# Altium schematic sheet Full Design.SchDoc
size A2; SheetNumber: 1; SheetTotal: 1
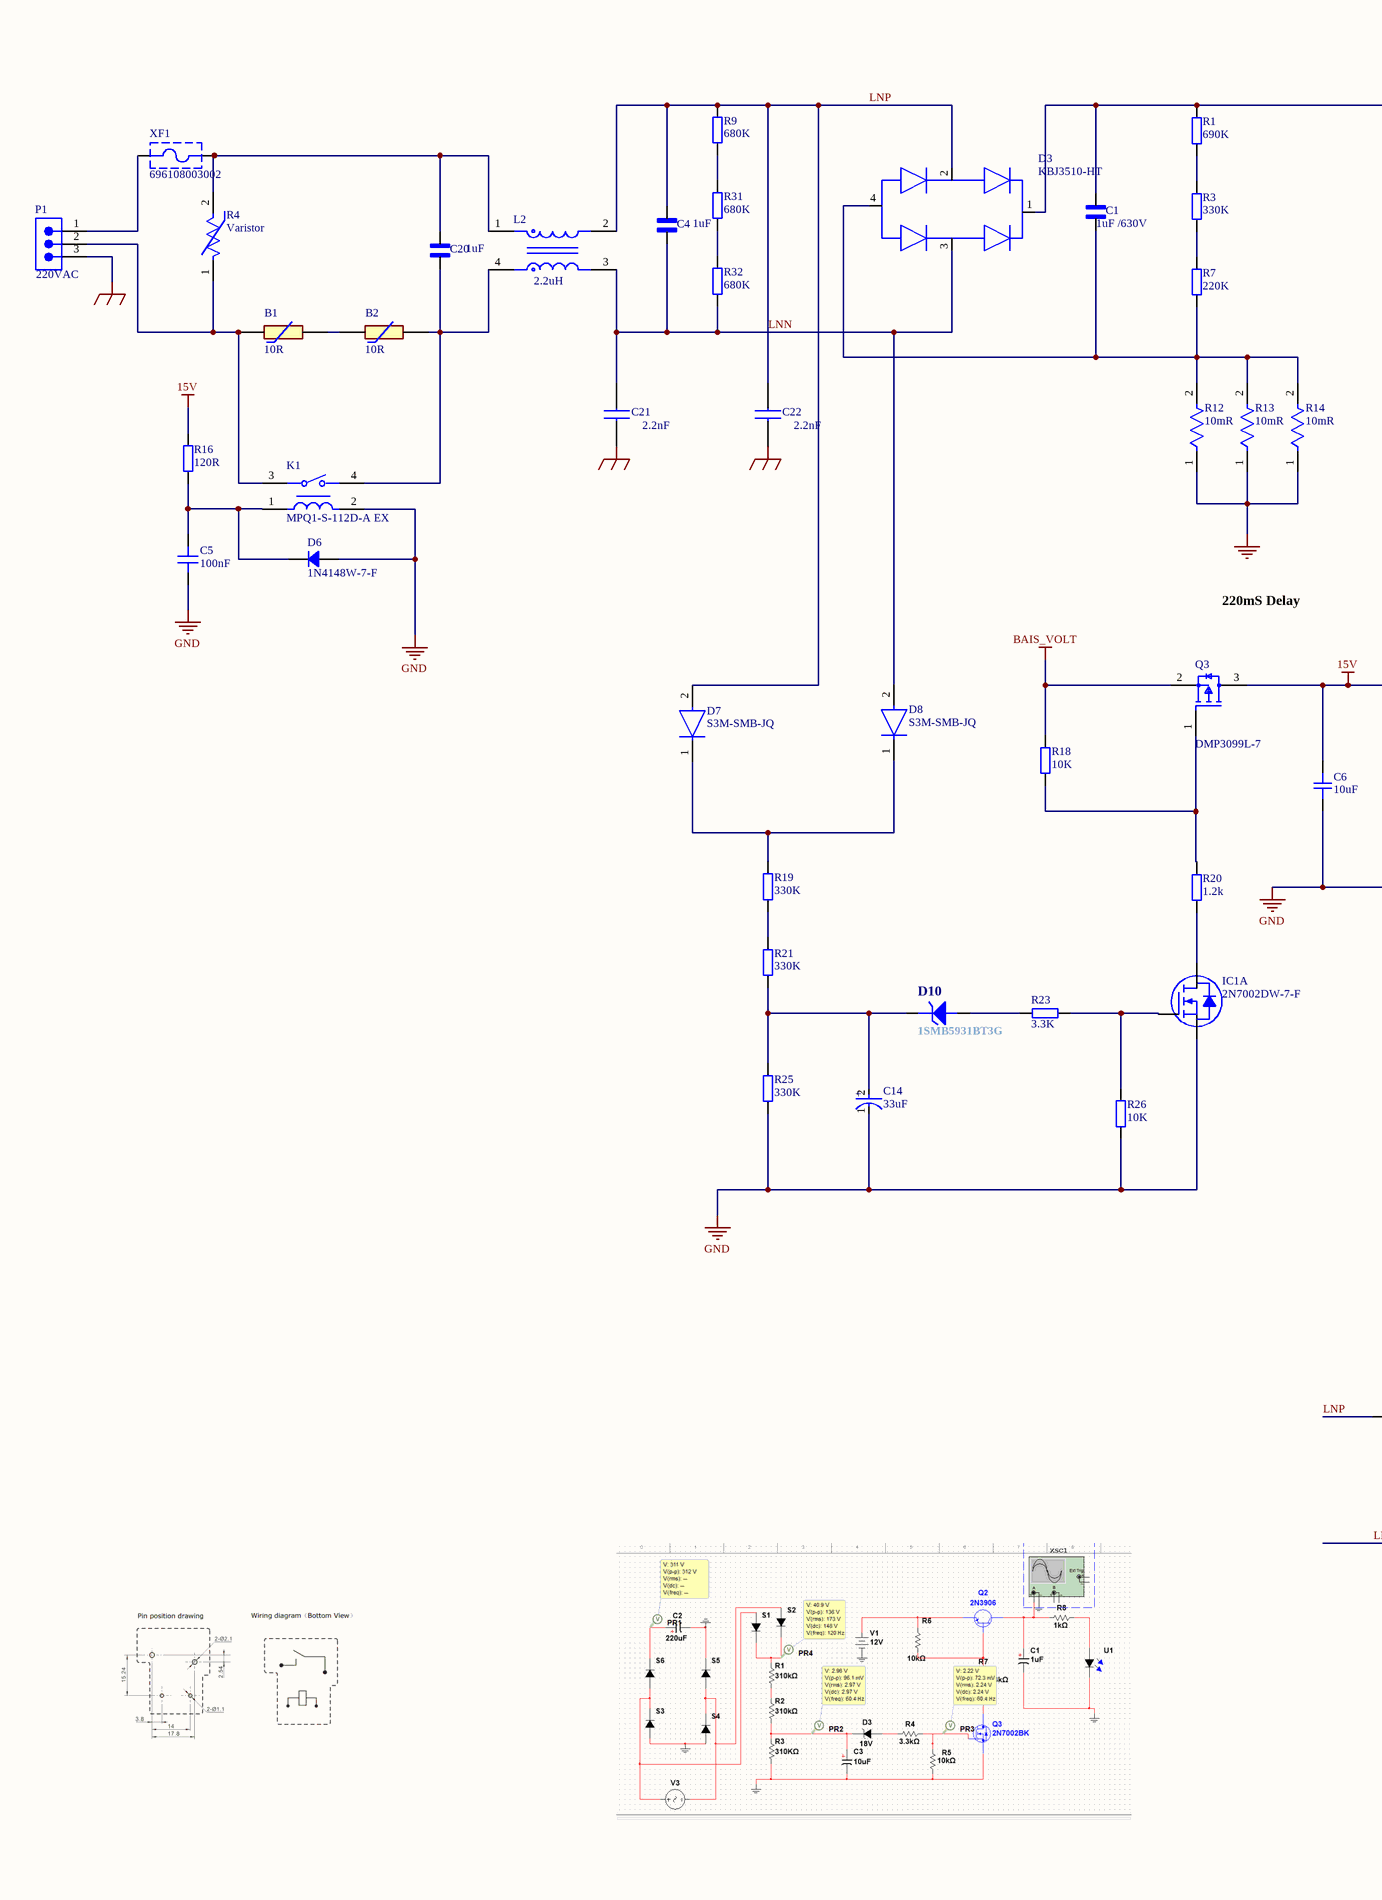
[diagram p0: Full Design.SchDoc, left]
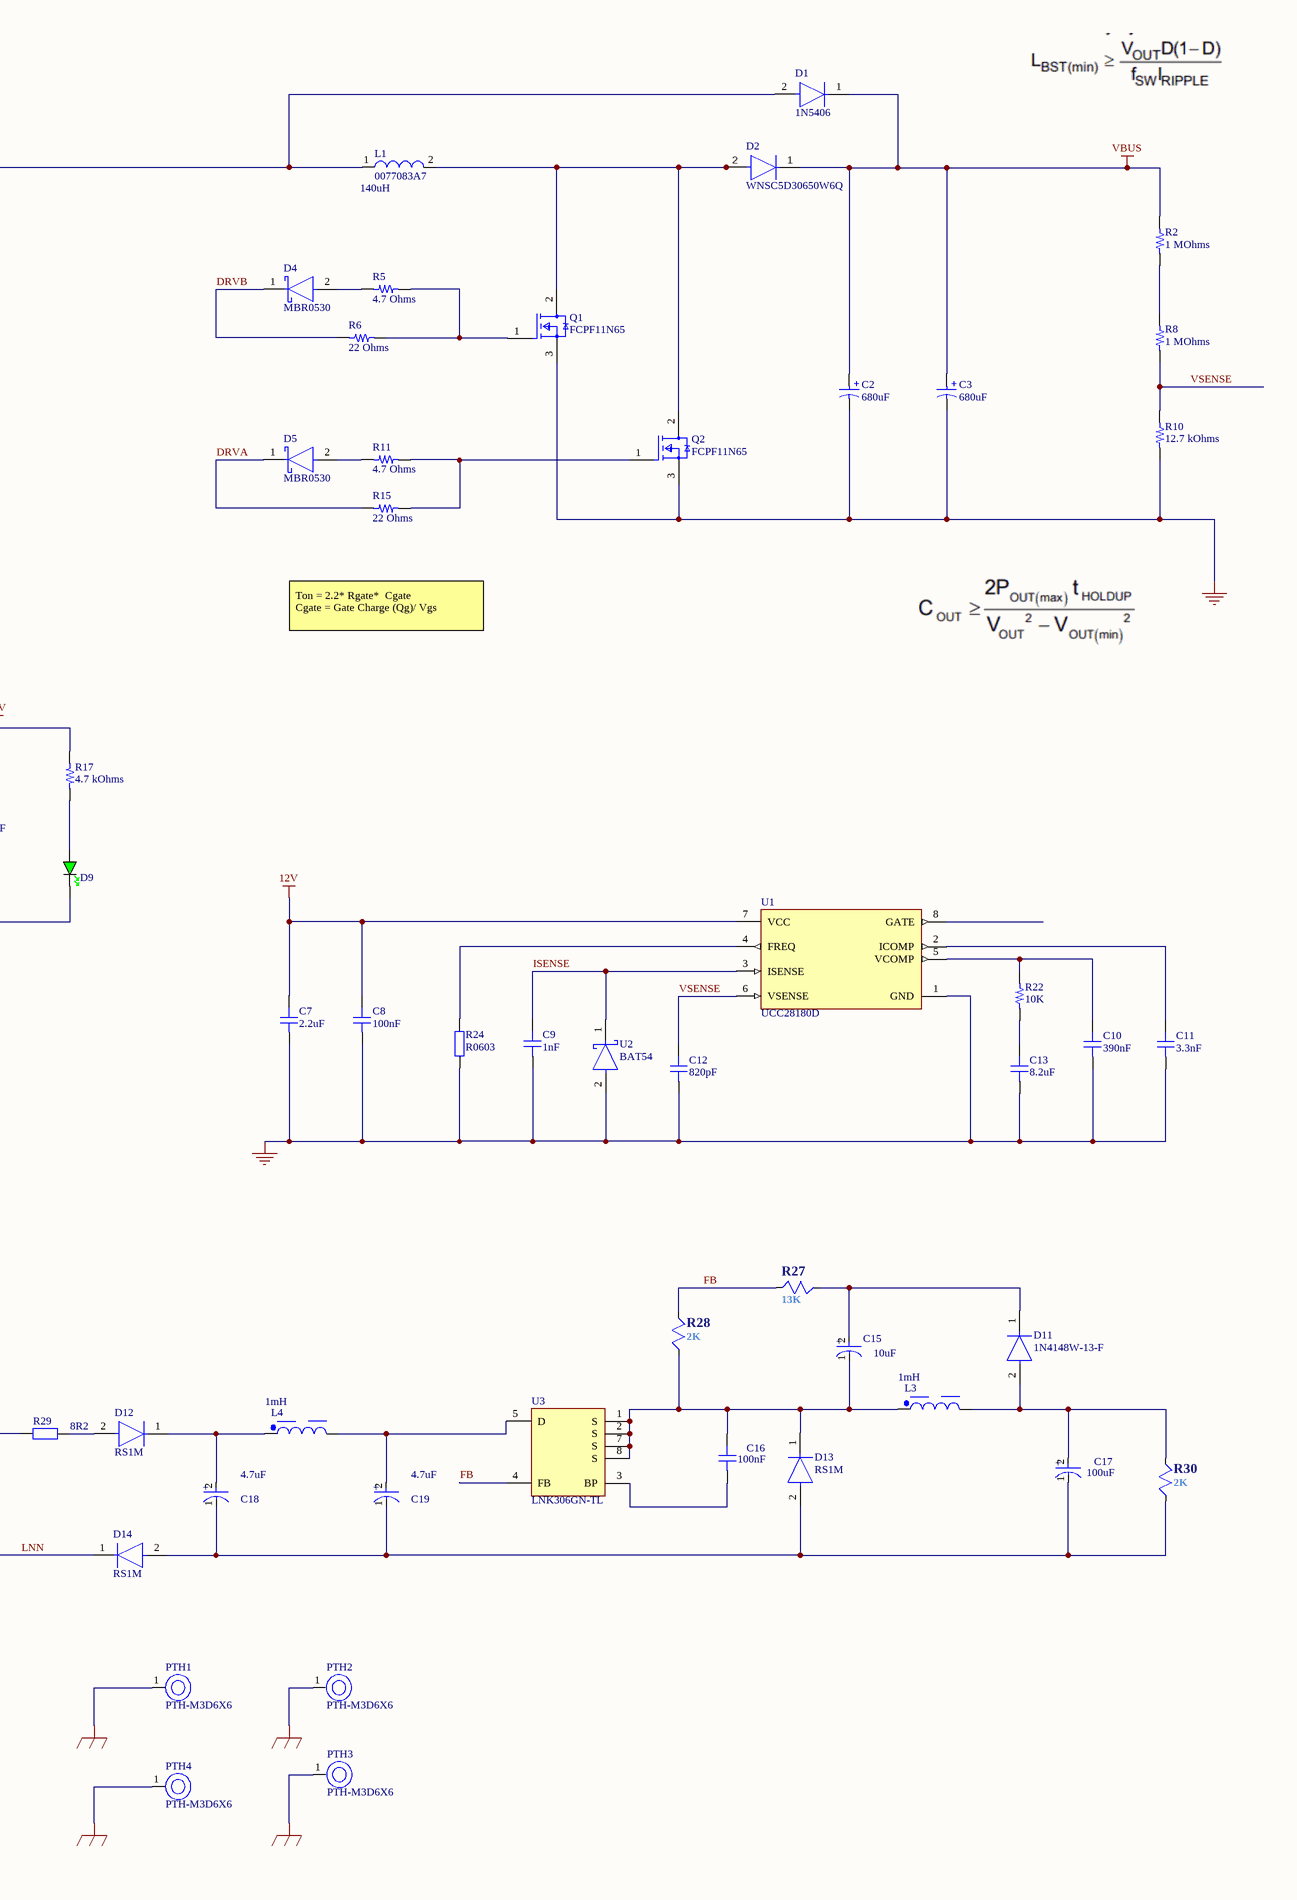
[diagram p1: Full Design.SchDoc, right]

## Parts
B1  value 10R  [B57237S0100M051]  (hidden comment: B57237S0100M051)
B2  value 10R  [B57237S0100M051]  (hidden comment: B57237S0100M051)
C1  value 1uF /630V  [CAPRR2750W80L3150T1100H1900]  (hidden comment: B32924C3105K189)
C2  680uF  [WCAP-AI3H_D35H55]
C3  680uF  [WCAP-AI3H_D35H55]
C4  value 1uF  [CAPRR2750W80L3150T1100H1900]  (hidden comment: B32924C3105K189)
C5  100nF  [CAP 0603_1608]
C6  10uF  [CAP_0805]
C7  2.2uF  [CAP_0805]
C8  100nF  [CAP_0805]
C9  1nF  [CAP_0805]
C10  390nF  [CAP_0805]
C11  3.3nF  [CAP_0805]
C12  820pF  [CAP_0805]
C13  8.2uF  [CAP_0805]
C14  33uF  [FP-FKE-MFG]
C15  Capacitance: 10uF  [FP-FKC-MFG]  (hidden comment: SC1V106M05005VR)
C16  Capacitance: 100nF  [CAP_1210]  (hidden comment: C1210C104KCRACTU)
C17  Capacitance: 100uF  [FP-SEV8X10_5-MFG]  (hidden comment: CKL025M101F10PKKKV00A)
C18  Capacitance: 4.7uF  [FP-RAD-TH-D_10_0_5-L_12_5-MFG]  (hidden comment: PKLH-400V4R7MG125-T/A5.0)
C19  Capacitance: 4.7uF  [FP-RAD-TH-D_10_0_5-L_12_5-MFG]  (hidden comment: PKLH-400V4R7MG125-T/A5.0)
C20  value 1uF  [CAPRR2750W80L3150T1100H1900]  (hidden comment: B32924C3105K189)
C21  value 2.2nF  [WYO222MCMBRAKR]  (hidden comment: WYO222MCMBRAKR)
C22  value 2.2nF  [WYO222MCMBRAKR]  (hidden comment: WYO222MCMBRAKR)
D1  1N5406  [FP-1N5406-E3-54-MFG]
D2  WNSC5D30650W6Q  [Diode]
D3  KBJ3510-HT  [DIOB_GBJ2510-F]
D4  MBR0530  [FP-425-04-MFG]
D5  MBR0530  [FP-425-04-MFG]
D6  1N4148W-7-F  [SOD-123]
D7  S3M-SMB-JQ  [FP-95401-MFG]
D8  S3M-SMB-JQ  [FP-95401-MFG]
D9  GREEN  [LED_0603_GREEN]  (value not drawn)
D10  1SMB5931BT3G  [SMB]
D11  1N4148W-13-F  [FP-SOD123-MFG]
D12  RS1M  [FP-403AE-MFG]
D13  RS1M  [FP-403AE-MFG]
D14  RS1M  [FP-403AE-MFG]
IC1  2N7002DW-7-F  [DIODES SOT-363]  (part A of 2)
K1  MPQ1-S-112D-A EX  [MPQ1-S-112D-A EX]
L1  0077083A7  Inductance: 140uH  [0077083A7]
L2  2.2uH  [FP-PLA10A-PLH10A-MFG]
L3  Inductance: 1mH  [WE-PD2_1054]  (hidden comment: FPI0705-102K(W0.15))
L4  Inductance: 1mH  [WE-PD2_1054]  (hidden comment: FPI0705-102K(W0.15))
P1  220VAC  [691311700003]
PTH1  PTH-M3D6X6  [PH3.2]
PTH2  PTH-M3D6X6  [PH3.2]
PTH3  PTH-M3D6X6  [PH3.2]
PTH4  PTH-M3D6X6  [PH3.2]
Q1  FCPF11N65  [FP-TO-220F-MFG]
Q2  FCPF11N65  [FP-TO-220F-MFG]
Q3  DMP3099L-7  [FP-SOT23-IPC_B]
R1  690K  [RES_0603]
R2  1 MOhms  [YAGEO RES 0402_1005]
R3  330K  [RES_0603]
R4  Varistor  [FP-B72214S0301K101-0]
R5  4.7 Ohms  [RES 0603_1608]
R6  22 Ohms  [RES 0603_1608]
R7  220K  [RES_0603]
R8  1 MOhms  [YAGEO RES 0402_1005]
R9  680K  [RES_0603]
R10  12.7 kOhms  [RES 0402_1005]
R11  4.7 Ohms  [RES 0603_1608]
R12  10mR  [FP-CSRN2512-IPC_A]
R13  10mR  [FP-CSRN2512-IPC_A]
R14  10mR  [FP-CSRN2512-IPC_A]
R15  22 Ohms  [RES 0603_1608]
R16  120R  [RES_0603]
R17  4.7 kOhms  [RES 0603_1608]
R18  10K  [RES_0603]
R19  330K  [RES_0603]
R20  1.2k  [RES_0603]
R21  330K  [RES_0603]
R22  10K  [RES 0402_1005]
R23  3.3K  [RES_0603]
R24  R0603  [RES_0603]
R25  330K  [RES_0603]
R26  10K  [RES_0603]
R27  value 13K  [RESC1608N]  (hidden comment: 0603SAF1302T5E)
R28  value 2K  [RESC1608N]  (hidden comment: HP03W5F2001T5E)
R29  value 8R2  [AXIAL-0.4]  (hidden comment: FKN2WSJT-73-10R)
R30  value 2K  [RESC1608N]  (hidden comment: HP03W5F2001T5E)
R31  680K  [RES_0603]
R32  680K  [RES_0603]
U1  UCC28180D  [FP-D0008A-MFG]
U2  BAT54  [FP-SOD323-MFG]
U3  LNK306GN-TL  [PI-SMD-8B-7_V]
XF1  696108003002  [696108003002]

## Nets
12V: C7.2 C8.2 U1.7(VCC)
15V: C6.1 Q3.3(D) R16.2 R17.1
BAIS_VOLT: Q3.2(S) R18.2
EARTH: C21.1 C22.1 P1.3 PTH1.1 PTH2.1 PTH3.1 PTH4.1
GND: C2.2(N) C3.2(N) C5.1 C6.2 C7.1 C8.1 C9.1 C10.1 C11.1 C12.1 C13.1 C14.1(C) D6.1 D9.K IC1.1(S1) K1.2 Q1.3(S) Q2.3(S) R10.2 R12.1 R13.1 R14.1 R24.1 R25.1 R26.1 U1.1(GND) U2.2(A)
VBUS: C2.1(P) C3.1(P) D1.1(C) D2.1(K) R2.2
DRVA: D5.1(C) R15.1
DRVB: D4.1(C) R6.1
FB: R27.2 R28.1 U3.4(FB)
ISENSE: C9.2 U1.3(ISENSE) U2.1(C)
LNN: C4.1 C4.2 C21.2 C22.2 D3.2 D3.3 D7.2(A) D8.2(A) D14.1(C) L2.2 L2.3 R9.2 R29.1 R32.1  [also labelled LNP]
VSENSE: C12.2 R8.1 R10.1 U1.6(VSENSE)
NetB1_1: B1.1 K1.3 P1.2 R4.1
NetB1_2: B1.2 B2.1
NetB2_2: B2.2 C20.1 K1.4 L2.4
NetC1_1: C1.1 D3.4 R7.1 R12.2 R13.2 R14.2
NetC1_2: C1.2 D1.2(A) D3.1 L1.1 R1.2
NetC5_2: C5.2 D6.2 K1.1 R16.1
NetC10_2: C10.2 R22.2 U1.5(VCOMP)
NetC11_2: C11.2 U1.2(ICOMP)
NetC13_2: C13.2 R22.1
NetC14_2: C14.2(A) D10.2(K) R21.1 R25.2
NetC15_1: C15.1(C) C16.2 D13.1(C) L3.1 R28.2 U3.1(S) U3.2(S) U3.7(S) U3.8(S)
NetC15_2: C15.2(A) D11.1(C) R27.1
NetC16_1: C16.1 U3.3(BP)
NetC17_1: C17.1(C) C18.1(C) C19.1(C) D13.2(A) D14.2(A) R30.2
NetC17_2: C17.2(A) D11.2(A) L3.2 R30.1
NetC18_2: C18.2(A) D12.1(C) L4.1
NetC19_2: C19.2(A) L4.2 U3.5(D)
NetC20_2: C20.2 L2.1 R4.2 XF1.2
NetD2_2: D2.2(A) L1.2 Q1.2(D) Q2.2(D)
NetD4_2: D4.2(A) R5.2
NetD5_2: D5.2(A) R11.2
NetD7_1: D7.1(C) D8.1(C) R19.2
NetD9_A: D9.A R17.2
NetD12_2: D12.2(A) R29.2
NetIC1_2: IC1.2(G1) R23.1 R26.2
NetIC1_6: IC1.6(D1) R20.2
NetP1_1: P1.1 XF1.1
NetQ1_1: Q1.1(G) R5.1 R6.2
NetQ2_1: Q2.1(G) R11.1 R15.2
NetQ3_1: Q3.1(G) R18.1 R20.1
NetR1_1: R1.1 R3.2
NetR2_1: R2.1 R8.2
NetR3_1: R3.1 R7.2
NetR9_1: R9.1 R31.2
NetR19_1: R19.1 R21.2
NetR24_2: R24.2 U1.4(FREQ)
NetR31_1: R31.1 R32.2

Not connected (* = marked no-connect by the designer): D10 1(A); R23 2; U1 8(GATE)

## Notes on the sheet
- Ton = 2.2* Rgate*  Cgate
  Cgate = Gate Charge (Qg)/ Vgs
- 220mS Delay
- (in symbol CMP-00287-05444366-1) +
- (in symbol CMP-03913-54202431-1) +
- (in symbol CMP-05427-000030-1) +
- (in symbol CMP-05427-001671-1) +
- (in symbol CMP-35376-000024-1) +

## Library data of the parts
B1 B2 = B57237S0100M051: NTC Inrush Current Limiters, Resistance (at 25)=10, Maximum Current=3.7A; Manufacturer_Name: TDK; Geometry.Height: 22mm; Mouser Part Number: 871-B57237S0100M051; Mouser Price/Stock: https://www.mouser.co.uk/ProductDetail/EPCOS-TDK/B57237S0100M051?qs=Uha62PnlbFC9mNcOyauoRw%3D%3D; Manufacturer_Part_Number: B57237S0100M051; Datasheet Link: https://product.tdk.com/system/files/dam/doc/product/protection/current/ntc-limiter/data_sheet/50/db/icl_16/s237.pdf
C1 = CAP_B32924C3105K189: CAP FILM 1UF 10% 630VDC RADIAL; MF: EPCOS - TDK Electronics; MP: B32924C3105K000; Package: THT; Price: None
C2 C3 = CMP-03913-54202431-1: CAP.EL.680uF ±20%  450V 2.2A 5000 Hrs @ 105°C; Polarity: Polar; ESR (Equivalent Series Resistance): 210mΩ; Pitch: 10mm; Life (Hours): 3000hours; Capacitance: 680µF; Leakage Current: 1.65952mA; Min Operating Temperature: -25°C; Height: 57mm; Diameter: 35mm; Mount: Through Hole; Ripple Current: 2.2A; Case/Package: Radial; Voltage Rating: 450V; RoHS: Compliant; REACH SVHC: Unknown; Height - Seated (Max): 59.0042mm; Length: 55mm; Lead Pitch: 10.0076mm; Tolerance: 20%; NexarPartId: 54202431; Max Operating Temperature: 105°C; Voltage Rating (DC): 450V
C4 C20 = CAP_B32924C3105K189: CAP FILM 1UF 10% 630VDC RADIAL; MF: {'manufacturer': u'EPCOS - TDK Electronics'}; MP: B32924C3105K000; Package: None; Price: None; Availability: Unavailable
C5 = C0603C105K4RACAUTO: CAP CER 1UF 16V X7R 0603; manufacturer: KEMET; Capacitance: 1 µF; Tolerance: ±10%; Part Number: C0603C105K4RACAUTO; Value: 100nF; Applications: Automotive, Bypass, Decoupling; componentlink1description: Datasheet; componentlink1url: https://api.kemet.com/component-edge/download/datasheet/C0603C105K4RACAUTO.pdf; componentlink2description: DigiKey Link; componentlink2url: https://www.digikey.com/en/products/detail/kemet/C0603C105K4RACAUTO/8635831; Device Package: 0603 (1608 Metric); lastupdated: 9.02.2024 20:10:30; Lifecycle Status: Active; Minimum Order: 1; Mounting Type: Surface Mount, MLCC; Operating Temperature: -55°C ~ 125°C; Package / Case: 0603 (1608 Metric); packaging: TapeAndReel; partid: 2179; Part Status: Active; price: 0.01; Ratings: AEC-Q200; series: SMD Auto X7R; Size / Dimension: 0.063" L x 0.031" W (1.60mm x 0.80mm); Supplier 1: DigiKey; Supplier Part Number 1: 399-17704-1-ND; Temperature Coefficient: X7R; Thickness (Max): 0.037" (0.95mm); Voltage - Rated: 16V
C6 C8-C13 = CAP_0805: Capacitor SMD 0805; Manufacturer: *; Manufacturer Part Number: *; Distributor Link: *; LCSC: *; Rating: *; Dielectric: *
C7 = CAP_0805: 2.2uF 50V; Manufacturer: *; Manufacturer Part Number: *; Distributor Link: *; LCSC: *; Rating: *; Dielectric: *
C14 = CMP-00287-05444366-1: BXJ50VC33MF80TP Aluminum Electrolytic Capacitor, 33 uF, 50 V, ± 20%, 2000 hours @ 105°C, Radial Can - SMD; Dielectric Material: Aluminium; Voltage: 50V; Capacitance: 33µF; Ripple Current (AC): 195mA; Lead Diameter: 650µm; Impedance: 680mΩ; Leakage Current: 16.5µA; Max Operating Temperature: 105°C; Contact Plating: Tin; Packaging: Cut Tape; Width: 8.3mm; Schedule B: 8532220020, 8532220020; Number of Pins: 2; RoHS: Compliant; Mount: PCB, Surface Mount; Diameter: 8mm; Material: Aluminium; Lead Free: Lead Free; Height - Seated (Max): 6.1976mm; Termination: SMD/SMT; ESR (Equivalent Series Resistance): 680mΩ; Voltage Rating (AC): 50V; Lifecycle Status: Production; Height: 6.2mm; Voltage Rating: 50V; Life (Hours): 2000hours; Lead Pitch: 2.2mm; NexarPartId: 5444366; Ripple Current: 195mA; REACH SVHC: No SVHC; Voltage Rating (DC): 50V; Length: 6.2mm; Tolerance: 20%; Min Operating Temperature: -55°C; Case/Package: Radial; Radiation Hardening: No
C15 = CMP-05427-000030-1: CAP.EL.10uF 35V 5x5.3 85C SMD SAMWHA; Impedance: 1.52R; Ripple Current (AC): 32mA; Tolerance: 20%; Ripple Current: 85mA; Life (Hours): 2000Hour; Leakage Current: 3uA; Voltage Rating (DC): 50V; Dielectric Material: Aluminium; Length: 5.8mm; Voltage Rating: 35V; Radiation Hardening: No; Max Operating Temperature: 105°C; REACH SVHC: No SVHC; RoHS Compliant: Yes; Case/Package: Radial; Height: 5.8mm; Voltage: 35V; Diameter: 5mm; Number of Pins: 2; Series: FK; Lead Free: Lead Free; Width: 6.5mm; ESR (Equivalent Series Resistance): 1.52R; Package Quantity: 1000; Construction: Cylindrical; Packaging: Tape and Reel; Height - Seated (Max): 0.228inch; Contact Plating: Tin; Min Operating Temperature: -55°C; Termination: SMD/SMT; Material: Aluminium; Mount: Surface Mount
C16 = CAP_1210: Capacitor SMD 1210; Manufacturer: KEMET; Rating: 500VDC; Manufacturer Part Number: C1210C104KCRACTU; Distributor Link: ÖZDİSAN
C17 = CMP-35376-000024-1: CAP.EL.100uF 25V 8x10 105C 5000H AEC-Q200 SMT; Polarity: Polar; Life (Hours): 2000Hour; Tolerance: 20%; Ripple Current: 240mA; Case/Package: Radial; Package Quantity: 1; Voltage Rating: 25V; Min Operating Temperature: -40°C; Lead Pitch: 3.1mm; Height - Seated (Max): 0.413inch; Ratings: AEC-Q200; Lead Free: Lead Free; Construction: Cylindrical; Max Operating Temperature: 85°C; Packaging: Tape and Reel; RoHS Compliant: Yes; Mount: Surface Mount; Radiation Hardening: No; Series: SEV
C18 C19 = CMP-05427-001671-1: CAP.EL.4u7 400V 10X12.5 5MM %20 105C LOW IMP; Dissipation Factor: 0.2%; Tolerance: 20%; Ripple Current (AC): 65mA; Polarity: Polar; Life (Hours): 2000Hour; Lead/Base Style: Straight; Lead Diameter: 0.6mm; Voltage Rating (DC): 350V; Length: 12.5mm; Height - Seated (Max): 0.531inch; Mount: Through Hole; Diameter: 10mm; Case/Package: Radial; Max Operating Temperature: 85°C; Ripple Current: 65mA; Radiation Hardening: No; Lead Pitch: 5mm; Packaging: Bulk; Termination: Radial; Construction: RADIAL; Series: M; REACH SVHC: No SVHC; RoHS Compliant: Yes; Voltage Rating: 350V; Min Operating Temperature: -25°C; Height: 12.5mm; Package Quantity: 200
C21 C22 = WYO222MCMBRAKR: 2200 pF +/-20% 440VAC Ceramic Capacitor Y5U (E) Radial, Disc; Manufacturer_Name: Vishay; Geometry.Height: 12mm; Manufacturer_Part_Number: WYO222MCMBRAKR; Mouser Part Number: 75-WYO222MCMBRAKR; Mouser Price/Stock: https://www.mouser.co.uk/ProductDetail/Vishay-Roederstein/WYO222MCMBRAKR?qs=2XxhnOlvGO7DwEDNcFgsAg%3D%3D; Arrow Part Number: WYO222MCMBRAKR; Arrow Price/Stock: https://www.arrow.com/en/products/wyo222mcmbrakr/vishay?utm_currency=USD&region=europe; Datasheet Link: http://www.vishay.com/docs/22202/wyo.pdf
D1 = CMP-02540-000085-1: DIODE GEN PURP 600V 3A DO201AD
D2 = Diode,: DIODE SIL.CARB.SCHOTTKY 30A 650V TO247F-2L THT
D3 = KBJ3510-HT: DIODE BRIDGE 35A 1000V 1PH KBJ THT
D4 D5 = CMP-2000-05113-2: DIODE SCHOTTKY 30V 500MA SOD123; Polarity: Standard; Max Reverse Leakage Current: 130uA; Forward Voltage: 430mV; Element Configuration: Single; Peak Non-Repetitive Surge Current: 5.5A; REACH SVHC: No SVHC; Contact Plating: Tin; Width: 1.6mm; Weight: 0.03g; Max Reverse Voltage (DC): 30V; Mount: Surface Mount; Max Repetitive Reverse Voltage (Vrrm): 30V; Number of Pins: 2; Height: 1.03mm; Current Rating: 500mA; Max Forward Surge Current (Ifsm): 5.5A; Lead Free: Lead Free; Max Surge Current: 5.5A; Peak Reverse Current: 130uA; Min Operating Temperature: -65°C; Radiation Hardening: No; Max Operating Temperature: 150°C; Average Rectified Current: 500mA; Packaging: Tape and Reel; Length: 2.7mm; Forward Current: 500mA; Voltage Rating (DC): 30V; Package Quantity: 1; Output Current: 500mA
D6 = 1N4148W-7-F: DIODE GEN PURP 100V 300MA SOD123; Manufacturer: Diodes Incorporated; Capacitance @ Vr, F: 2pF @ 0V, 1MHz; Current - Reverse Leakage @ Vr: 1 µA @ 100 V; Diode Type: Standard; Reverse Recovery Time (trr): 4 ns; Speed: Fast Recovery =< 500ns, > 200mA (Io); Voltage - Forward (Vf) (Max) @ If: 1.25 V @ 150 mA; Part Number: 1N4148W-7-F; ComponentLink1Description: Datasheet; ComponentLink1URL: https://www.diodes.com/assets/Datasheets/ds30086.pdf; ComponentLink2Description: DigiKey Link; ComponentLink2URL: https://www.digikey.com/en/products/detail/diodes-incorporated/1N4148W-7-F/814371; Current - Average Rectified (Io): 300mA; LastUpdated: 3.06.2024 19:54:46; Lifecycle Status: Active; Minimum Order: 1; Mounting Type: Surface Mount; Operating Temperature - Junction: -55°C ~ 150°C; Package / Case: SOD-123; Packaging: TapeAndReel; PartId: 1002; Part Status: Active; Price: 0.02; Series: -; Supplier 1: DigiKey; Supplier Part Number 1: 1N4148W-FDICT-ND; Supplier Device Package: SOD-123; Voltage - DC Reverse (Vr) (Max): 100 V
D7 = CMP-02540-000081-1: DIODE STAND. Single 3A 1000V SMT DO214AA; Max Reverse Voltage (DC): 1kV; Max Reverse Current: 1uA; Forward Current: 1.5A; Polarity: Standard; Recovery Time: 2000ns; Max Forward Surge Current (Ifsm): 50A; Forward Voltage: 1.15V; Capacitance: 16pF; Reverse Recovery Time: 2us; Series: -; Lead Free: Lead Free; Voltage Rating (DC): 1kV; Packaging: Tape and Reel; Average Rectified Current: 1.5A; Max Repetitive Reverse Voltage (Vrrm): 1kV; Max Operating Temperature: 150°C; Length: 4.57mm; Element Configuration: Single; Current Rating: 1.5A; Mount: Surface Mount; Radiation Hardening: No; Peak Non-Repetitive Surge Current: 50A; Case/Package: SMB; Output Current: 1.5A; Reverse Voltage: 1kV; Min Operating Temperature: -55°C; Height: 2.24mm; Width: 3.94mm; Package Quantity: 750; RoHS Compliant: Yes; Max Surge Current: 50A; Number of Pins: 2
D8 = CMP-02540-000081-1: -DIODE STAND. Single 3A 1000V SMT DO214AA; Max Reverse Voltage (DC): 1kV; Max Reverse Current: 1uA; Forward Current: 1.5A; Polarity: Standard; Recovery Time: 2000ns; Max Forward Surge Current (Ifsm): 50A; Forward Voltage: 1.15V; Capacitance: 16pF; Reverse Recovery Time: 2us; Series: -; Lead Free: Lead Free; Voltage Rating (DC): 1kV; Packaging: Tape and Reel; Average Rectified Current: 1.5A; Max Repetitive Reverse Voltage (Vrrm): 1kV; Max Operating Temperature: 150°C; Length: 4.57mm; Element Configuration: Single; Current Rating: 1.5A; Mount: Surface Mount; Radiation Hardening: No; Peak Non-Repetitive Surge Current: 50A; Case/Package: SMB; Output Current: 1.5A; Reverse Voltage: 1kV; Min Operating Temperature: -55°C; Height: 2.24mm; Width: 3.94mm; Package Quantity: 750; RoHS Compliant: Yes; Max Surge Current: 50A; Number of Pins: 2
D9 = LED_0603_GREEN: LED 0603 GREEN SMD
D10 = ZENER-1_1: DIODE ZENER 3W 18V ±5% DO214AA (SMB) SMT; Mfr_Name: *
D11 = CMP-12791-000005-1: DIODE GEN PURP 100V 150MA SOD123; Manufacturer: Diodes Inc.; Capacitance: 2pF; Forward Current: 300mA; Max Junction Temp: +150°C; Value: 2pF; Standoff Height: 0mm; Peak Reverse Current: 1uA; Max Surge Forward Current: 1A; Category: Diode; Height: 1.45mm; ComponentLink2URL: https://upverter.com/datasheet/628e7d6fee5901eee6eef4567d1c3569f2cd3cde.pdf; Lead Free: Yes; ComponentLink2Description: Datasheet; Octopart: https://octopart.com/1n4148w-13-f-diodes+inc.-2359612; Temperature Range High: +150°C; Device Class L2: Diodes; Digikey Description: DIODE GEN PURP 100V 150MA SOD123; Reverse Voltage: 100V; Temperature Range Low: -65°C; Device Class L1: Discrete Semiconductors; Package: SOD123; RoHS: TRUE; Manufacturer Part Number: 1N4148W-13-F; Footprint Url: https://www.diodes.com/assets/Package-Files/SOD123.pdf; Automotive: No; Max Repetitive Reverse Voltage: 100V; Mouser Description: 1N4148W Series 2 A 100 V 400 mW Surface Mount Fast Switching Diode - SOD-123; Temperature: -65°C to +150°C; Device Class L3: Rectifier Diodes
D12-D14 = CMP-07163-000022-1: DIODE GEN PURP 1KV 1A SMA; Manufacturer: ON Semiconductor; Max Surge Forward Current: 30A; Max Repetitive Reverse Voltage: 1000V; Value: 10pF; Max Junction Temp: +150°C; Peak Reverse Current: 5uA; Standoff Height: 0.05mm; ComponentLink2URL: https://www.onsemi.com/pub/Collateral/RS1M-D.PDF; Footprint Url: https://www.onsemi.com/pub/Collateral/403AE.PDF; Mouser Description: On a Reel of 7500, ON Semi 1000V 1A, Diode, 2-Pin DO-214AC RS1M; Package: 403AE; Manufacturer Part Number: RS1M; Temperature Range Low: -55°C; Device Class L1: Discrete Semiconductors; Automotive: No; Height: 2.5mm; Octopart: https://octopart.com/rs1m-on+semiconductor-84331238; Digikey Description: DIODE GEN PURP 1KV 1A SMA; Temperature Range High: +150°C; Capacitance: 10pF; RoHS: TRUE; Device Class L2: Diodes; ComponentLink2Description: Datasheet; Temperature: -55°C to +150°C; Device Class L3: Rectifier Diodes; Forward Current: 1A; Lead Free: Yes; Category: Diode
IC1 = 2N7002DW-7-F: MOSFET 2N-CH 60V 0.23A SOT-363; Manufacturer: Diodes Incorporated; Current - Continuous Drain (Id) @ 25°C: 230mA; FET Feature: Standard; FET Type: 2 N-Channel (Dual); Input Capacitance (Ciss) (Max) @ Vds: 50pF @ 25V; Power - Max: 310mW; Rds On (Max) @ Id, Vgs: 7.5Ohm @ 50mA, 5V; Vgs(th) (Max) @ Id: 2V @ 250µA; Part Number: 2N7002DW-7-F; ComponentLink1Description: Datasheet; ComponentLink1URL: https://www.diodes.com/assets/Datasheets/ds30120.pdf; ComponentLink2Description: DigiKey Link; ComponentLink2URL: http://digikey.com/product-detail/en/diodes-incorporated/2N7002DW-7-F/2N7002DW-FDICT-ND/750003; Drain to Source Voltage (Vdss): 60V; LastUpdated: 3.06.2024 20:24:04; Lifecycle Status: Active; Minimum Order: 1; Mounting Type: Surface Mount; Operating Temperature: -55°C ~ 150°C (TJ); Package / Case: 6-TSSOP, SC-88, SOT-363; Packaging: TapeAndReel; Part Status: Active; Price: 0.06; Series: -; Supplier 1: DigiKey; Supplier Part Number 1: 2N7002DW-FDICT-ND; Supplier Device Package: SOT-363
K1 = RELAY_MPQ1-S-112D-A EX: RELAY POWER 30A 12VDC FormA PCB EXPLOSION PROOF
L1 = 0077083A7: Coated Kool Mu Ferrite Core Toroid Type Length Width 1.605" (40.77mm) Diameter 0.605" (15.37mm) Height
L2 = CMP-06045-000412-1: Common Mode Choke Dual 20mH 0.5A 1.8Ω DCR Thru-Hole Bulk; Voltage Rating (DC): 300V; Lead/Base Style: Pin; RMS Current (Irms): 500mA; Shielding: Unshielded; DC Resistance (DCR): 100mR; Current Rating: 500uA; Number of Lines: 2; Lead Diameter: 0.9mm; Mount: Through Hole; Military Standard: Not; Min Operating Temperature: -25°C; REACH SVHC: No SVHC; Lead Free: Lead Free; Termination: Radial; Number of Pins: 4; Max DC Current: 500mA; Package Quantity: 1260; Lead Pitch: 13mm; Radiation Hardening: No; Inductance: 20mH; Length: 18mm; DC Current: 500mA; Max Operating Temperature: 120°C; Width: 0.63inch; Voltage Rating: 300V; Depth: 16mm; Height: 17.5mm; Packaging: Bulk; Insulation Resistance: 100MR; Voltage Rating (AC): 300V; Current: 500mA
L3 L4 = CMP-0227-00499-2: INDUCTOR POWER 1mH 7.8X7.0X5.0MM SMD; Test Frequency: 10kHz; DC Resistance (DCR): 3.3 Ohm; RMS Current (Irms): 380mA; Tolerance: 10%; Inductance Tolerance: 20%; Shielding: Unshielded; Core Material: Ferrite; Packaging: Digi-Reel®; Composition: Wirewound; Lead Free: Lead Free; Min Operating Temperature: -40°C; Saturation Current: N/A; RoHS: Compliant; Height - Seated (Max): 5.8928mm; Ambient Temperature Range Low: -40°C; Case/Package: Nonstandard; Termination: SMD/SMT; REACH SVHC: Unknown; Width: 10mm; Ambient Temperature Range High: 85°C; Length: 9mm; Mount: Surface Mount; Height: 5.4mm; Max Operating Temperature: 125°C
P1 = CMP-1502-02027-2: NexarPartId: 18818305; Gender: Male; Number of Contacts: 3; Connector Type: PCB, Terminal Block; Voltage: 300V; Number of Levels: 1; Current: 20A; Pitch: 5.0038mm; Termination: Solder; Orientation: Vertical; Height: 12mm; Mount: Through Hole; REACH SVHC: Unknown; Contact Material: Brass; Number of Rows: 1; Width: 15mm; Packaging: Box; Color: Green; Length: 8.5mm; Number of Positions Per Level: 3; Lead Pitch: 5mm; Number of Pins: 3; RoHS: Compliant
PTH1-PTH4 = PTH_S1
Q1 Q2 = CMP-00278-84409178-1: FCPF11N65 Res Thick Film 1210 13.7 Ohm 1% 1/2W 100ppm/C Molded SMD Embossed Carrier T/R; Continuous Drain Current (ID): 11A; Rds On Max: 380mΩ; Drain to Source Voltage (Vdss): 650V; Max Power Dissipation: 36W; Input Capacitance: 1.49nF; RoHS: Compliant; NexarPartId: 84409178; Mount: Through Hole; Case/Package: TO-220-3
Q3 = CMP-12801-000062-2: MOSFET P-CH 30V SOT23; Gate to Source Voltage (Vgs): 20V; Turn-Off Delay Time: 31ns; Drain to Source Voltage (Vdss): -30V; Fall Time: 15ns; Threshold Voltage: -2.1V; Rise Time: 5ns; Input Capacitance: 563pF; Number of Channels: 1; Drain to Source Resistance: 65mR; Element Configuration: Single; Max Power Dissipation: 1.08W; Turn-On Delay Time: 4.8ns; Continuous Drain Current (ID): 3.8A; Lead Free: Lead Free; Number of Pins: 3; Package Quantity: 3000; Width: 1.4mm; Radiation Hardening: No; Mount: Surface Mount; Case/Package: SOT-23; Contact Plating: Tin; Rds On Max: 65mR; Height: 1.1mm; REACH SVHC: No SVHC; Weight: 0.000282oz; Max Operating Temperature: 150°C; Packaging: Tape and Reel; Min Operating Temperature: -55°C; Length: 3mm
R1 R3 R7 R9 R16 R18-R21 R23-R26 R31 R32 = RES_0603: Resistor SMD 0603; Manufacturer: *; Manufacturer Part Number: *; Distributor Link: *; LCSC: *
R2 R8 = AC0402FR-131ML: RES 1 MOHM 1% 1/16W 0402; Manufacturer: Yageo; Power (Watts): 0.063W, 1/16W; Temperature Coefficient: ±100ppm/°C; Part Number: AC0402FR-131ML; Value: 1 MOhms; ComponentLink1Description: Datasheet; ComponentLink1URL: https://www.yageo.com/upload/media/product/productsearch/datasheet/rchip/PYu-AC_51_RoHS_L_10.pdf; ComponentLink2Description: DigiKey Link; ComponentLink2URL: https://www.digikey.com/en/products/detail/yageo/AC0402FR-131ML/17006779; Composition: Thick Film; Device Package: 0402 (1005 Metric); Features: Automotive AEC-Q200, Moisture Resistant; Height - Seated (Max): 0.015" (0.37mm); LastUpdated: 25.07.2024 09:17:54; Lifecycle Status: Active; Minimum Order: 1; Number of Terminations: 2; Operating Temperature: -55°C ~ 155°C; Package / Case: 0402 (1005 Metric); Packaging: CutTape; PartId: 85922; Price: 0.01; Ratings: AEC-Q200; Resistance: 1 MOhms; Series: AC; Size / Dimension: 0.039" L x 0.020" W (1.00mm x 0.50mm); Supplier 1: DigiKey; Supplier Part Number 1: 13-AC0402FR-131MLCT-ND; Supplier Device Package: 0402; Tolerance: ±1%
R4 = CMP-10618-000016-1: VARISTOR 470V 4.5KA DISC 14MM; Energy: 76J; Clamping Voltage: 775V; Voltage Rating (AC): 300V; Lead Length: 30mm; Capacitance: 300pF; Lead/Base Style: Radial; Tolerance: 10%; Clamping Current: 50A; Max Voltage Rating (DC): 385V; Packaging: Bulk; Min Operating Temperature: -40°C; Max Operating Temperature: 85°C; Depth: 5.2mm; Lead Pitch: 7.5mm; Max Surge Current: 4.5kA; Package Quantity: 500; RoHS Compliant: Yes; Max Voltage Rating (AC): 300V; Mount: Radial; Varistor Voltage: 470V; REACH SVHC: No SVHC; Thickness: 5.2mm; Series: StandardD; Diameter: 14mm; Weight: 0.141096oz; Voltage Tolerance: 10%; Voltage Rating (DC): 385V
R5 R11 = CR0603-J/-4R7ELF: RES SMD 4.7 OHM 5% 1/10W 0603; Manufacturer: Bourns Inc.; Power (Watts): 0.1W, 1/10W; Part Number: CR0603-J/-4R7ELF; Value: 4.7 Ohms; ComponentLink1Description: Datasheet; ComponentLink1URL: https://www.bourns.com/docs/Product-Datasheets/CHPREZTR.pdf; ComponentLink2Description: DigiKey Link; ComponentLink2URL: https://www.digikey.com/en/products/detail/bourns-inc/CR0603-J-4R7ELF/3784252; Composition: Thick Film; Device Package: 0603 (1608 Metric); Features: Moisture Resistant; Height - Seated (Max): 0.022" (0.55mm); LastUpdated: 9.02.2024 20:43:30; Lifecycle Status: Active; Minimum Order: 1; Number of Terminations: 2; Operating Temperature: -55°C ~ 155°C; Package / Case: 0603 (1608 Metric); Packaging: CutTape; PartId: 6593; Part Status: Active; Price: 0.01; Resistance: 4.7 Ohms; Series: CR0603; Size / Dimension: 0.063" L x 0.031" W (1.60mm x 0.80mm); Supplier 1: DigiKey; Supplier Part Number 1: CR0603-J/-4R7ELFCT-ND; Supplier Device Package: 0603; Tolerance: ±5%
R6 R15 = CR0603-JW-220ELF: RES SMD 22 OHM 5% 1/10W 0603; Manufacturer: Bourns Inc.; Power (Watts): 0.1W, 1/10W; Temperature Coefficient: ±200ppm/°C; Part Number: CR0603-JW-220ELF; Value: 22 Ohms; ComponentLink1Description: Datasheet; ComponentLink1URL: https://www.bourns.com/docs/Product-Datasheets/CHPREZTR.pdf; ComponentLink2Description: DigiKey Link; ComponentLink2URL: https://www.digikey.com/en/products/detail/bourns-inc/CR0603-JW-220ELF/3741007; Composition: Thick Film; Device Package: 0603 (1608 Metric); Features: Moisture Resistant; Height - Seated (Max): 0.022" (0.55mm); LastUpdated: 9.02.2024 20:43:32; Lifecycle Status: Active; Minimum Order: 1; Number of Terminations: 2; Operating Temperature: -55°C ~ 155°C; Package / Case: 0603 (1608 Metric); Packaging: CutTape; PartId: 6027; Part Status: Active; Price: 0.01; Resistance: 22 Ohms; Series: CR0603; Size / Dimension: 0.063" L x 0.031" W (1.60mm x 0.80mm); Supplier 1: DigiKey; Supplier Part Number 1: CR0603-JW-220ELFCT-ND; Supplier Device Package: 0603; Tolerance: ±5%
R10 = RMCF0402FT12K7: RES 12.7K OHM 1% 1/16W 0402; Manufacturer: Stackpole Electronics Inc; Power (Watts): 0.063W, 1/16W; Temperature Coefficient: ±100ppm/°C; Part Number: RMCF0402FT12K7; Value: 12.7 kOhms; ComponentLink1Description: Datasheet; ComponentLink1URL: https://www.seielect.com/catalog/sei-rmcf_rmcp.pdf; ComponentLink2Description: DigiKey Link; ComponentLink2URL: https://www.digikey.com/en/products/detail/stackpole-electronics-inc/RMCF0402FT12K7/1761410; Composition: Thick Film; Device Package: 0402 (1005 Metric); Features: Automotive AEC-Q200; Height - Seated (Max): 0.016" (0.40mm); LastUpdated: 9.02.2024 20:29:45; Lifecycle Status: Active; Minimum Order: 1; Number of Terminations: 2; Operating Temperature: -55°C ~ 155°C; Package / Case: 0402 (1005 Metric); Packaging: CutTape; PartId: 13497; Part Status: Active; Price: 0.01; Ratings: AEC-Q200; Resistance: 12.7 kOhms; Series: RMCF; Size / Dimension: 0.039" L x 0.020" W (1.00mm x 0.50mm); Supplier 1: DigiKey; Supplier Part Number 1: RMCF0402FT12K7CT-ND; Supplier Device Package: 0402; Tolerance: ±1%
R12 R13 = CMP-26527-006297-1: PE2512FKE7W0R01L  2512 10m Ohms 1% 2W 50PPM; Temperature Coefficient: 200ppm/°C; Case Code (Imperial): 2512; Radiation Hardening: No; Resistor Type: Thick Film; Depth: 3.15mm; Min Operating Temperature: -55°C; Military Standard: Not; Height: 0.028inch; Length: 0.25inch; Width: 0.124inch; Mount: Surface Mount; Max Operating Temperature: 155°C; Case/Package: 2512; Packaging: Tape and Reel; Series: CSRN; Power Rating: 2W; Contact Plating: Tin; Max Power Dissipation: 2W; Construction: Rectangular; RoHS Compliant: Yes; Lead Free: Lead Free; Case Code (Metric): 6432; Number of Terminations: 2; Resistance: 10mR; Tolerance: 1%
R14 = CMP-26527-006297-1: PE2512FKE7W0R01L 2512 10m Ohms 1% 2W 50PPM; Temperature Coefficient: 200ppm/°C; Case Code (Imperial): 2512; Radiation Hardening: No; Resistor Type: Thick Film; Depth: 3.15mm; Min Operating Temperature: -55°C; Military Standard: Not; Height: 0.028inch; Length: 0.25inch; Width: 0.124inch; Mount: Surface Mount; Max Operating Temperature: 155°C; Case/Package: 2512; Packaging: Tape and Reel; Series: CSRN; Power Rating: 2W; Contact Plating: Tin; Max Power Dissipation: 2W; Construction: Rectangular; RoHS Compliant: Yes; Lead Free: Lead Free; Case Code (Metric): 6432; Number of Terminations: 2; Resistance: 10mR; Tolerance: 1%
R17 = CR0603-JW-472ELF: RES SMD 4.7K OHM 5% 1/10W 0603; Manufacturer: Bourns Inc.; Power (Watts): 0.1W, 1/10W; Temperature Coefficient: ±200ppm/°C; Part Number: CR0603-JW-472ELF; Value: 4.7 kOhms; ComponentLink1Description: Datasheet; ComponentLink1URL: https://www.bourns.com/docs/Product-Datasheets/CHPREZTR.pdf; ComponentLink2Description: DigiKey Link; ComponentLink2URL: https://www.digikey.com/en/products/detail/bourns-inc/CR0603-JW-472ELF/3593210; Composition: Thick Film; Device Package: 0603 (1608 Metric); Features: Moisture Resistant; Height - Seated (Max): 0.022" (0.55mm); LastUpdated: 9.02.2024 20:43:33; Lifecycle Status: Active; Minimum Order: 1; Number of Terminations: 2; Operating Temperature: -55°C ~ 155°C; Package / Case: 0603 (1608 Metric); Packaging: CutTape; PartId: 5872; Part Status: Active; Price: 0.01; Resistance: 4.7 kOhms; Series: CR0603; Size / Dimension: 0.063" L x 0.031" W (1.60mm x 0.80mm); Supplier 1: DigiKey; Supplier Part Number 1: CR0603-JW-472ELFCT-ND; Supplier Device Package: 0603; Tolerance: ±5%
R22 = TNPW040222K9BEED: RES 22.9K OHM 0.1% 1/16W 0402; Manufacturer: Vishay Dale; Power (Watts): 0.063W, 1/16W; Resistance: 22.9 kOhms; Temperature Coefficient: ±25ppm/°C; Part Number: TNPW040222K9BEED; Value: 10K; ComponentLink1Description: Datasheet; ComponentLink1URL: http://www.vishay.com/docs/28758/tnpw_e3.pdf; ComponentLink2Description: DigiKey Link; ComponentLink2URL: https://www.digikey.com/en/products/detail/vishay-dale/TNPW040222K9BEED/4972275; Composition: Thin Film; Device Package: 0402 (1005 Metric); Features: Anti-Sulfur, Automotive AEC-Q200, Moisture Resistant; Height - Seated (Max): 0.016" (0.40mm); LastUpdated: 9.02.2024 20:29:59; Lifecycle Status: Active; Minimum Order: 1; Number of Terminations: 2; Operating Temperature: -55°C ~ 155°C; Package / Case: 0402 (1005 Metric); Packaging: TapeAndReel; PartId: 8876; Part Status: Active; Price: 0.10; Ratings: AEC-Q200; Series: TNPW e3; Size / Dimension: 0.039" L x 0.020" W (1.00mm x 0.50mm); Supplier 1: DigiKey; Supplier Part Number 1: 541-4482-1-ND; Supplier Device Package: 0402; Tolerance: ±0.1%
R27 = RES: RES.(1608) 0603 13K Ohms 1% 1/10W-S 100PPM
R28 R30 = RES: RES.(1608) 0603 2K Ohms 1% 1/5W
R29 = Res2: Resistor; Published: 8-Jun-2000; LatestRevisionDate: 17-Jul-2002; LatestRevisionNote: Re-released for DXP Platform.; PackageReference: AXIAL-0.4; Publisher: Altium Limited; PackageDescription: Axial Device, Thru-Hole; 2 Leads; 0.4 in Pin Spacing
U1 = CMP-04918-000038-1: IC PFC CTRLR AVERAGE CURR 8SOIC; Manufacturer: Texas Instruments; Max Supply Voltage: 21V; Output Type: Fixed; Max Duty Cycle: 98%; Number Of Outputs: 1; Output Voltage: 390mV; Standoff Height: 0.11mm; Output Current: 40uA; Nominal Supply Current: 7mA; Switching Frequency: 65kHz; Max Junction Temp: +125°C; Switching Topology: Buck; Lead Free: Yes; Height: 1.75mm; Automotive: No; Category: IC; Device Class L1: Integrated Circuits (ICs); Octopart: https://octopart.com/ucc28180d-texas+instruments-31566950; Mouser Description: Power Factor Correction - PFC 8-PIN CCM PFC CONTROLLER; Ipc Land Pattern Name: SOIC127P600X175-8; RoHS: TRUE; Temperature: -40°C to +125°C; Package: D0008A; Temperature Range High: +125°C; Device Class L3: Voltage Regulators - Switching; ComponentLink2Description: Datasheet; Device Class L2: Power Management ICs; Manufacturer Part Number: UCC28180D; Temperature Range Low: -40°C; Digikey Description: IC PFC CTRLR AVERAGE CURR 8SOIC; ComponentLink2URL: http://www.ti.com/lit/ds/symlink/ucc28180.pdf
U2 = CMP-2000-05927-2: DIODE SCHOTTKY 40V 300MA SOD323; Manufacturer Part Number: BAT54JFILM; Manufacturer: STMicroelectronics; Max Surge Forward Current: 1.25A; Value: 7pF; Max Junction Temp: +150°C; Peak Reverse Current: 1uA; Standoff Height: 0mm; ComponentLink2Description: Datasheet; Device Class L2: Diodes; Mouser Description: Schottky Diodes & Rectifiers 300mA 40 Volt; Forward Current: 300mA; Temperature Range Low: -40°C; Temperature Range High: +150°C; Digikey Description: DIODE SCHOTTKY 40V 300MA SOD323; Capacitance: 7pF; Ipc Land Pattern Name: SOD250128X117-2; Automotive: No; Device Class L1: Discrete Semiconductors; Lead Free: Yes; ComponentLink2URL: https://www.st.com/resource/en/datasheet/bat54.pdf; Package: SOD323; Temperature: -40°C to +150°C; Category: IC; Height: 1.17mm; Octopart: https://octopart.com/bat54jfilm-stmicroelectronics-326073; RoHS: TRUE; Device Class L3: Schottky Diodes; Max Repetitive Reverse Voltage: 40V
U3 = CMP-2000-06569-1: Lowest Component Count, Energy-Efficient Off-Line Switcher IC, 85 to 265 V, 220 uA, -40 to 150 degC, 7-Pin SMD, RoHS, Tube; Manufacturer: Power Integrations; Output type: Adjustable; Function: Regulator; Topology: Flyback; Input voltage: 85...265VAC; Mounting Technology: SurfaceMount; Datasheet Version: Rev. J, 06/2013; Datasheet URL: http://www.mouser.com/ds/2/328/lnk302_304-306-179954.pdf; Package Reference: SMD-8B-7; Manufacturer URL: https://www.power.com/; Package: SMD-8B(7-PIN); Package Description: 7-Pin Surface Mount Device, Body 9.575 x 6.35 mm
XF1 = CMP-1502-00237-2: NexarPartId: 56808807; Voltage Rating (AC): 250V; Fuse Current: 10A; REACH SVHC: Unknown; RoHS: Non-Compliant; Mount: Through Hole; Packaging: Box